# Altium project ultrabassman-pcba.PrjPcb
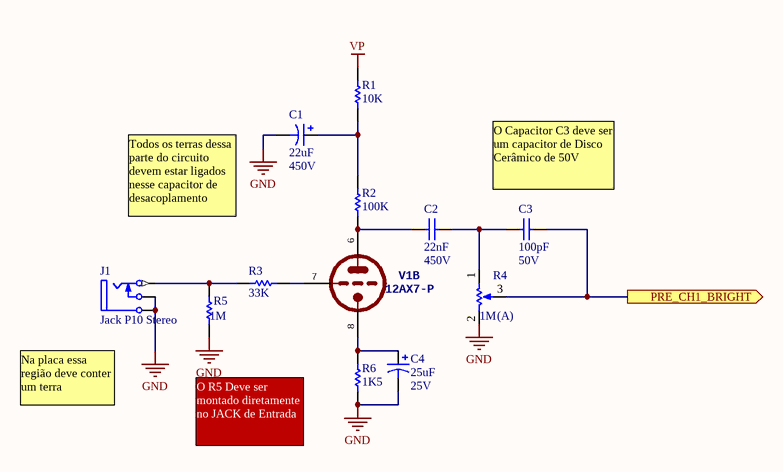
[diagram p0: preamp_chanel1_bright.SchDoc]
6 sheets, 93 parts. Net scope: global (net labels, ports and power ports of the same name join across sheets).
Board file: PCB_A.PcbDoc
Sheets:
  preamp_chanel1_bright.SchDoc
  preamp_chanel2_normal.SchDoc
  preamp_gain_stage_2.SchDoc
  fxloop.SchDoc
  poweramp_phase_splitter.SchDoc
  heaters.SchDoc

## Sheet preamp_chanel1_bright.SchDoc: Bassman Preamp Chanel 1 Bright
size A4; ProjectName: Ultra Bassman 50W

### Parts
C1  value 22uF  Voltage: 450V  [RAD-POL-7.6-15]  (hidden comment: Cap Pol Rad)
C2  value 22nF  Voltage: 450V  [ORANGE-DROP-100nF]  (hidden comment: Polyester Film)
C3  value 100pF  Voltage: 50V  [RAD-0.2]  (hidden comment: Ceramic Cap)
C4  value 25uF  Voltage: 25V  [AXIAL-POL-30mm]  (hidden comment: Cap Pol Axial)
J1  Jack P10 Stereo  [JACK-STEREO-3PAD]
R1  value 10K  [AXIAL-0.6]  (hidden comment: Metal Film Resistor 1/2W)
R2  value 100K  [AXIAL-0.6]  (hidden comment: Metal Film Resistor 1/2W)
R3  value 33K  [AXIAL-0.6]  (hidden comment: Metal Film Resistor 1/2W)
R4  value 1M  TYPE: (A)  [pot_alpha - 2.54mm]  (hidden comment: ALPHA Potentiometer)
R5  value 1M  [AXIAL-0.6]  (hidden comment: Metal Film Resistor 1/2W)  (mechanical)
R6  value 1K5  [AXIAL-0.6]  (hidden comment: Metal Film Resistor 1/2W)
V1  12AX7-P  [NOVAL]  (part B of 3)

### Ports
PRE_CH1_BRIGHT (out)

### Nets
GND: C1.2 C4.2 J1.2(TN) J1.5(S) R4.2(BOT) R5.1 R6.1
VP: R1.2
PRE_CH1_BRIGHT: C3.2 R4.3(TAP) ; port PRE_CH1_BRIGHT
NetC1_1: C1.1 R1.1 R2.2
NetC2_1: C2.1 R2.1 V1.6(TA)
NetC2_2: C2.2 C3.1 R4.1(TOP)
NetC4_1: C4.1 R6.2 V1.8(TK)
NetJ1_1: J1.1(T) R3.2 R5.2
NetR3_1: R3.1 V1.7(TG)

### Notes on the sheet
- Todos os terras dessa parte do circuito devem estar ligados nesse capacitor de desacoplamento
- (near C3) O Capacitor C3 deve ser um capacitor de Disco Cerâmico de 50V
- (near J1) Na placa essa região deve conter um terra
- O R5 Deve ser montado diretamente no JACK de Entrada

### Library data of the parts
C1 = Cap Pol Rad: Polarized Capacitor (Axial); Published: 8-Jun-2000; LatestRevisionDate: 17-Jul-2002; LatestRevisionNote: Re-released for DXP Platform.; PackageReference: POLAR0.8; Publisher: Altium Limited; PackageDescription: Polarized Capacitor; 2 Leads
C2 = Cap-PFilm: Capacitor; Published: 8-Jun-2000; LatestRevisionDate: 17-Jul-2002; LatestRevisionNote: Re-released for DXP Platform.; PackageReference: RAD-0.3; Publisher: Altium Limited; PackageDescription: Radial Cap, Thru-Hole; 2 Leads; 0.3 in Pin Spacing
C3 = Cap-Ceramic-Small: Capacitor; Published: 8-Jun-2000; LatestRevisionDate: 17-Jul-2002; LatestRevisionNote: Re-released for DXP Platform.; PackageReference: RAD-0.3; Publisher: Altium Limited; PackageDescription: Radial Cap, Thru-Hole; 2 Leads; 0.3 in Pin Spacing
C4 = Cap Pol Axial: Polarized Capacitor Axial; Published: 8-Jun-2000; LatestRevisionDate: 12-Feb-2014; LatestRevisionNote: Re-released for DXP Platform.; PackageReference: POLAR0.8; Publisher: Whitesheep Amps; PackageDescription: Polarized Capacitor; 2 Leads
J1 = Jack P10 Stereo: Jack Socket, 1/4" [6.5mm], Thru-Hole, Vertical, 2-Conductor with Tip closed; PackageDocument: 2003; PCB_Layout: Complies with manufacturer's recommendation.; DrillAndSlotSize: Corresponds to nominal value.; LatestRevisionDate: 15-Jul-2004; LatestRevisionNote: Component Replaced & renamed from "Phonejack".; DatasheetDocument: 2003; PackageReference: S1VS_SNB; Publisher: Altium Limited; ComponentLink1Description: Manufacturer Link; ComponentLink1URL: http://www.cliffuk.co.uk/
R1-R3 R5 R6 = Res Metal Film 1/2W: Semiconductor Resistor; Published: 8-Jun-2000; LatestRevisionDate: 17-Jul-2002; LatestRevisionNote: 12-Fev-2014; PackageReference: AXIAL-0.6; Publisher: Whitesheep Amps; PackageDescription: Axial Device, Thru-Hole; 2 Leads; 0.5 in Pin Spacing; Power: 1/2W
R4 = alpha-pot: Potentiometer; Sim Note: Enter the Resistance value and the set point into parameter fields.; Set Position: 0.5; Published: 8-Jun-2000; LatestRevisionDate: 17-Jul-2002; LatestRevisionNote: Re-released for DXP Platform.; PackageReference: VR5; Publisher: Altium Limited; PackageDescription: Variable Resistor, Thru-Hole; 3 Leads

## Sheet preamp_chanel2_normal.SchDoc
size A4
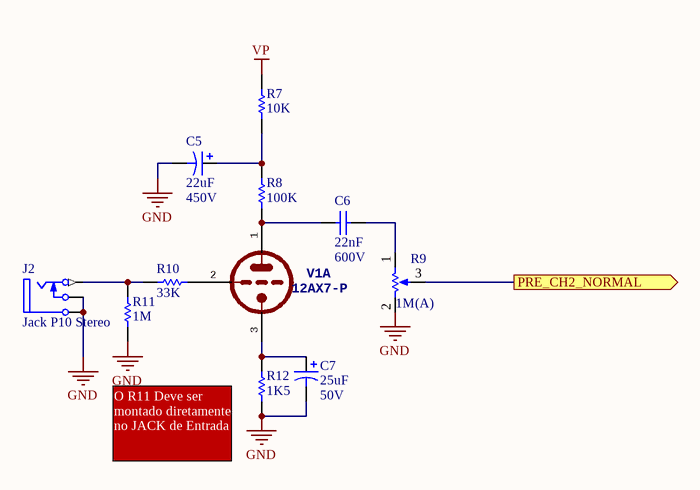
[diagram p1: preamp_chanel2_normal.SchDoc]

### Parts
C5  value 22uF  Voltage: 450V  [RAD-POL-7.6-15]  (hidden comment: Cap Pol Rad)
C6  value 22nF  Voltage: 600V  [ORANGE-DROP-100nF]  (hidden comment: Orange Drop Capacitor)
C7  value 25uF  Voltage: 50V  [AXIAL-POL-30mm]  (hidden comment: Cap Pol Axial)
J2  Jack P10 Stereo  [JACK-STEREO-3PAD]
R7  value 10K  [AXIAL-0.6]  (hidden comment: Metal Film Resistor 1/2W)
R8  value 100K  [AXIAL-0.6]  (hidden comment: Metal Film Resistor 1/2W)
R9  value 1M  TYPE: (A)  [pot_alpha - 2.54mm]  (hidden comment: ALPHA Potentiometer)
R10  value 33K  [AXIAL-0.6]  (hidden comment: Metal Film Resistor 1/2W)
R11  value 1M  [AXIAL-0.6]  (hidden comment: Metal Film Resistor 1/2W)  (mechanical)
R12  value 1K5  [AXIAL-0.6]  (hidden comment: Metal Film Resistor 1/2W)
V1  12AX7-P  [NOVAL]  (part A of 3)

### Ports
PRE_CH2_NORMAL (out)

### Nets
GND: C5.2 C7.2 J2.2(TN) J2.5(S) R9.2(BOT) R11.1 R12.1
VP: R7.2
PRE_CH2_NORMAL: R9.3(TAP) ; port PRE_CH2_NORMAL
NetC5_1: C5.1 R7.1 R8.2
NetC6_1: C6.1 R8.1 V1.1(TA)
NetC6_2: C6.2 R9.1(TOP)
NetC7_1: C7.1 R12.2 V1.3(TK)
NetJ2_1: J2.1(T) R10.2 R11.2
NetR10_1: R10.1 V1.2(TG)

### Notes on the sheet
- (near R12) O R11 Deve ser montado diretamente no JACK de Entrada

### Library data of the parts
C5 = Cap Pol Rad: Polarized Capacitor (Axial); Published: 8-Jun-2000; LatestRevisionDate: 17-Jul-2002; LatestRevisionNote: Re-released for DXP Platform.; PackageReference: POLAR0.8; Publisher: Altium Limited; PackageDescription: Polarized Capacitor; 2 Leads
C6 = Cap-Orange-DROP-22nF-600V: Capacitor; Published: 8-Jun-2000; LatestRevisionDate: 17-Jul-2002; LatestRevisionNote: Re-released for DXP Platform.; PackageReference: RAD-0.3; Publisher: Altium Limited; PackageDescription: Radial Cap, Thru-Hole; 2 Leads; 0.3 in Pin Spacing
C7 = Cap Pol Axial: Polarized Capacitor Axial; Published: 8-Jun-2000; LatestRevisionDate: 12-Feb-2014; LatestRevisionNote: Re-released for DXP Platform.; PackageReference: POLAR0.8; Publisher: Whitesheep Amps; PackageDescription: Polarized Capacitor; 2 Leads
J2 = Jack P10 Stereo: as J1 on sheet preamp_chanel1_bright; LatestRevisionDate: 15-Jul-2004; LatestRevisionNote: Component Replaced & renamed from "Phonejack".; DatasheetDocument: 2003; PackageReference: S1VS_SNB; Publisher: Altium Limited; ComponentLink1Description: Manufacturer Link; ComponentLink1URL: http://www.cliffuk.co.uk/
R7 R8 R10-R12 = Res Metal Film 1/2W: Semiconductor Resistor; Published: 8-Jun-2000; LatestRevisionDate: 17-Jul-2002; LatestRevisionNote: 12-Fev-2014; PackageReference: AXIAL-0.6; Publisher: Whitesheep Amps; PackageDescription: Axial Device, Thru-Hole; 2 Leads; 0.5 in Pin Spacing; Power: 1/2W
R9 = alpha-pot: as R4 on sheet preamp_chanel1_bright; Published: 8-Jun-2000; LatestRevisionDate: 17-Jul-2002; LatestRevisionNote: Re-released for DXP Platform.; PackageReference: VR5; Publisher: Altium Limited; PackageDescription: Variable Resistor, Thru-Hole; 3 Leads

## Sheet preamp_gain_stage_2.SchDoc
size A4
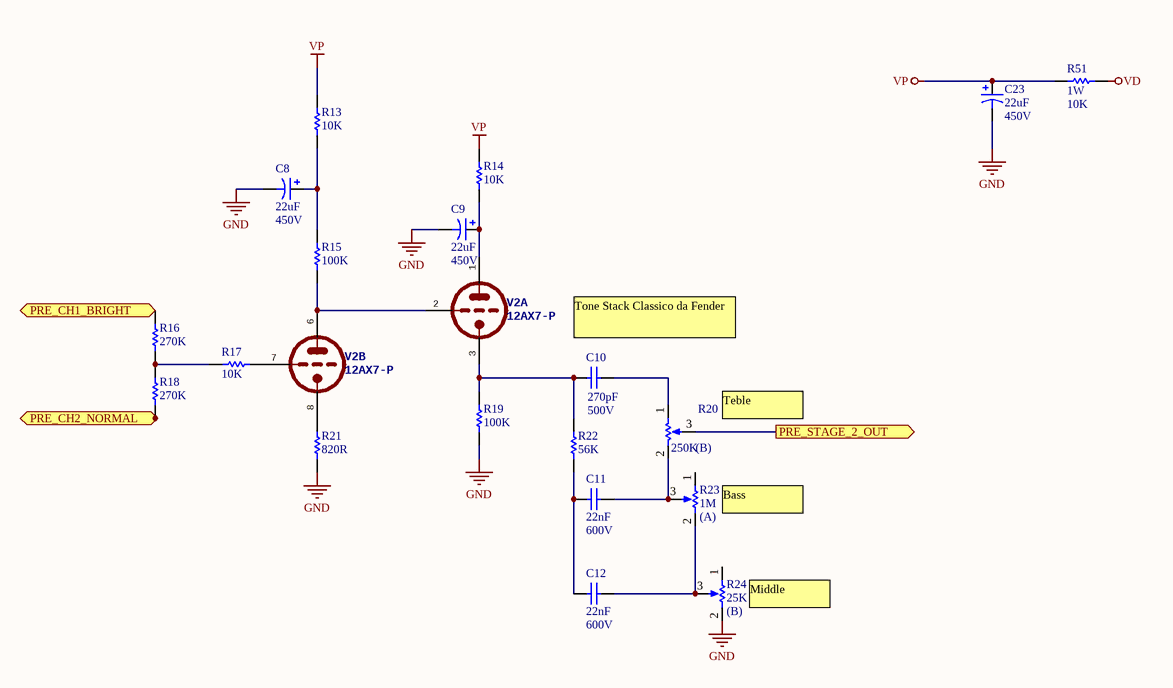
[diagram p2: preamp_gain_stage_2.SchDoc]

### Parts
C8  value 22uF  Voltage: 450V  [RAD-POL-7.6-15]  (hidden comment: Cap Pol Rad)
C9  value 22uF  Voltage: 450V  [RAD-POL-7.6-15]  (hidden comment: Cap Pol Rad)
C10  value 270pF  Voltage: 500V  [RAD-0.3]  (hidden comment: Cap)
C11  value 22nF  Voltage: 600V  [ORANGE-DROP-22nF-600V]  (hidden comment: Orange Drop Capacitor)
C12  value 22nF  Voltage: 600V  [ORANGE-DROP-22nF-600V]  (hidden comment: Orange Drop Capacitor)
C23  value 22uF  Voltage: 450V  [RAD-POL-7.6-15]  (hidden comment: Cap Pol Rad)
R13  value 10K  [AXIAL-0.6]  (hidden comment: Metal Film Resistor 1/2W)
R14  value 10K  [AXIAL-0.6]  (hidden comment: Metal Film Resistor 1/2W)
R15  value 100K  [AXIAL-0.6]  (hidden comment: Metal Film Resistor 1/2W)
R16  value 270K  [AXIAL-0.6]  (hidden comment: Metal Film Resistor 1/2W)
R17  value 10K  [AXIAL-0.6]  (hidden comment: Metal Film Resistor 1/2W)
R18  value 270K  [AXIAL-0.6]  (hidden comment: Metal Film Resistor 1/2W)
R19  value 100K  [AXIAL-0.6]  (hidden comment: Metal Film Resistor 1/2W)
R20  value 250K  TYPE: (B)  [pot_alpha - 2.54mm]  (hidden comment: ALPHA Potentiometer)
R21  value 820R  [AXIAL-0.6]  (hidden comment: Metal Film Resistor 1/2W)
R22  value 56K  [AXIAL-0.6]  (hidden comment: Metal Film Resistor 1/2W)
R23  value 1M  TYPE: (A)  [pot_alpha - 2.54mm]  (hidden comment: ALPHA Potentiometer)
R24  value 25K  TYPE: (B)  [pot_alpha - 2.54mm]  (hidden comment: ALPHA Potentiometer)
R51  value 10K  Power: 1W  [AXIAL-0.6]  (hidden comment: Metal Film Resistor 1W)
V2  12AX7-P  [NOVAL]  (parts A,B of 3)

### Ports
PRE_CH1_BRIGHT (in), PRE_CH2_NORMAL (in), PRE_STAGE_2_OUT (out)

### Nets
GND: C8.2 C9.2 C23.2 R19.2 R21.2 R24.2(BOT)
VD: R51.2
VP: C23.1 R13.1 R14.1 R51.1
PRE_CH1_BRIGHT: R16.1 ; port PRE_CH1_BRIGHT
PRE_STAGE_2_OUT: R20.3(TAP) ; port PRE_STAGE_2_OUT
NetC8_1: C8.1 R13.2 R15.1
NetC9_1: C9.1 R14.2 V2.1(TA)
NetC10_1: C10.1 R19.1 R22.1 V2.3(TK)
NetC10_2: C10.2 R20.1(TOP)
NetC11_1: C11.1 C12.1 R22.2
NetC11_2: C11.2 R20.2(BOT) R23.3(TAP)
NetC12_2: C12.2 R23.2(BOT) R24.3(TAP)
NetR15_2: R15.2 V2.2(TG) V2.6(TA)
NetR16_2: R16.2 R17.1 R18.1
NetR17_2: R17.2 V2.7(TG)
NetR21_1: R21.1 V2.8(TK)

Not connected (* = marked no-connect by the designer): R18 2; R23 1(TOP); R24 1(TOP)

### Notes on the sheet
- (near C10) Tone Stack Classico da Fender
- (near R20) Teble
- (near R23) Bass
- (near R24) Middle

### Library data of the parts
C8 C9 C23 = Cap Pol Rad: Polarized Capacitor (Axial); Published: 8-Jun-2000; LatestRevisionDate: 17-Jul-2002; LatestRevisionNote: Re-released for DXP Platform.; PackageReference: POLAR0.8; Publisher: Altium Limited; PackageDescription: Polarized Capacitor; 2 Leads
C10 = Cap: Capacitor; Published: 8-Jun-2000; LatestRevisionDate: 17-Jul-2002; LatestRevisionNote: Re-released for DXP Platform.; PackageReference: RAD-0.3; Publisher: Altium Limited; PackageDescription: Radial Cap, Thru-Hole; 2 Leads; 0.3 in Pin Spacing
C11 C12 = Cap-Orange-DROP-22nF-600V: Capacitor; ManufacturerPartNumber: 715P22356KD3; Published: 23-April-2014; LatestRevisionDate: 23-April-2014; LatestRevisionNote: Creating the document; PackageReference: Orange Drop; Publisher: Linda HB Amplifiers; PackageDescription: Radial Cap, Thru-Hole; 2 Leads; 9.75mm Pin Spacing
R13-R19 R21 R22 = Res Metal Film 1/2W: Semiconductor Resistor; Published: 8-Jun-2000; LatestRevisionDate: 17-Jul-2002; LatestRevisionNote: 12-Fev-2014; PackageReference: AXIAL-0.6; Publisher: Whitesheep Amps; PackageDescription: Axial Device, Thru-Hole; 2 Leads; 0.5 in Pin Spacing; Power: 1/2W
R20 R23 R24 = alpha-pot: as R4 on sheet preamp_chanel1_bright; Published: 8-Jun-2000; LatestRevisionDate: 17-Jul-2002; LatestRevisionNote: Re-released for DXP Platform.; PackageReference: VR5; Publisher: Altium Limited; PackageDescription: Variable Resistor, Thru-Hole; 3 Leads
R51 = Res Wire Wound 1W: Semiconductor Resistor; Published: 8-Jun-2000; LatestRevisionDate: 29-Mar-2014; LatestRevisionNote: 19-Mar-2014; PackageReference: AXIAL-0.5; Publisher: Linda Hand Buit Amplifiers; PackageDescription: Axial Device, Thru-Hole; 2 Leads; 0.5 in Pin Spacing

## Sheet fxloop.SchDoc
size A4
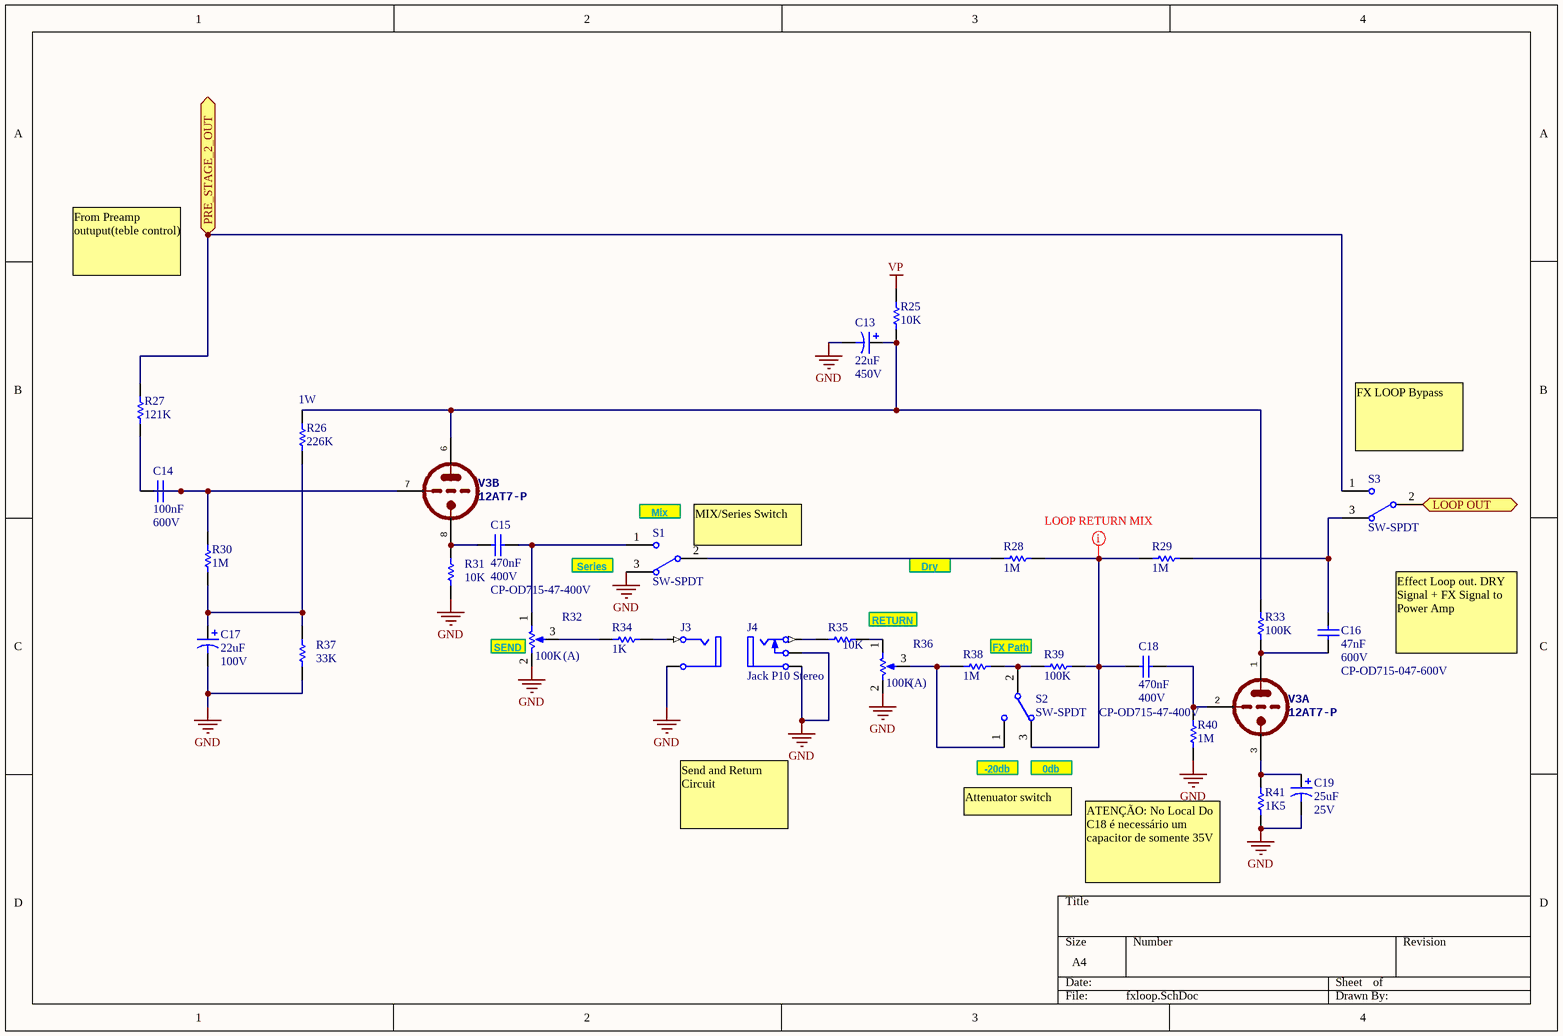
[diagram p3: fxloop.SchDoc]

### Parts
C13  value 22uF  Voltage: 450V  [RAD-POL-7.6-15]  (hidden comment: Cap Pol Rad)
C14  value 100nF  Voltage: 600V  [ORANGE-DROP-100nF]  (hidden comment: Orange Drop Capacitor)
C15  value 470nF  Voltage: 400V  TUBE_DEPOT_SN: CP-OD715-47-400V  [ORANGE-DROP-470-nF-400V]  (hidden comment: Orange Drop Capacitor)
C16  value 47nF  Voltage: 600V  TUBEDEPOT_SN: CP-OD715-047-600V  [ORANGE-DROP-47nF-600V]  (hidden comment: Orange Drop Capacitor)
C17  value 22uF  Voltage: 100V  [RAD-POL-16x20x7.5]  (hidden comment: Cap Pol Radial Vishay 22uF 100V)
C18  value 470nF  Voltage: 400V  TUBE_DEPOT_SN: CP-OD715-47-400V  [ORANGE-DROP-470-nF-400V]  (hidden comment: Orange Drop Capacitor)
C19  value 25uF  Voltage: 25V  [AXIAL-POL-30mm]  (hidden comment: Cap Pol Axial)
J3  Jack Mono  [JACK-MONO-PCB-MINI]  (value not drawn)
J4  Jack P10 Stereo  [JACK-STEREO-3PAD]
R25  value 10K  [AXIAL-0.6]  (hidden comment: Metal Film Resistor 1/2W)
R26  value 226K  Power: 1W  [AXIAL-0.6]  (hidden comment: Metal Film Resistor 1/2W)
R27  value 121K  [AXIAL-0.6]  (hidden comment: Metal Film Resistor 1/2W)
R28  value 1M  [AXIAL-0.6]  (hidden comment: Metal Film Resistor 1/2W)
R29  value 1M  [AXIAL-0.6]  (hidden comment: Metal Film Resistor 1/2W)
R30  value 1M  [AXIAL-0.6]  (hidden comment: Metal Film Resistor 1/2W)
R31  value 10K  [AXIAL-0.6]  (hidden comment: Metal Film Resistor 1/2W)
R32  value 100K  TYPE: (A)  [pot_alpha - 2.54mm]  (hidden comment: ALPHA Potentiometer)
R33  value 100K  [AXIAL-0.6]  (hidden comment: Metal Film Resistor 1/2W)
R34  value 1K  [AXIAL-0.6]  (hidden comment: Metal Film Resistor 1/2W)
R35  value 10K  [AXIAL-0.6]  (hidden comment: Metal Film Resistor 1/2W)
R36  value 100K  TYPE: (A)  [pot_alpha - 2.54mm]  (hidden comment: ALPHA Potentiometer)
R37  value 33K  [AXIAL-0.6]  (hidden comment: Metal Film Resistor 1/2W)
R38  value 1M  [AXIAL-0.6]  (hidden comment: Metal Film Resistor 1/2W)
R39  value 100K  [AXIAL-0.6]  (hidden comment: Metal Film Resistor 1/2W)
R40  value 1M  [AXIAL-0.6]  (hidden comment: Metal Film Resistor 1/2W)
R41  value 1K5  [AXIAL-0.6]  (hidden comment: Metal Film Resistor 1/2W)
S1  SW-SPDT  [SPDT]
S2  SW-SPDT  [SPDT]
S3  SW-SPDT  [SPDT]
V3  12AT7-P  [NOVAL]  (parts A,B of 3)

### Ports
LOOP OUT (out), PRE_STAGE_2_OUT (in)

### Nets
GND: C13.2 C17.2 C19.2 J3.2(S) J4.2(TN) J4.5(S) R31.2 R32.2(BOT) R36.2(BOT) R37.2 R40.1 R41.1 S1.3
VP: R25.2
LOOP OUT: S3.2 ; port LOOP OUT
PRE_STAGE_2_OUT: R27.2 S3.1 ; port PRE_STAGE_2_OUT
NetC13_1: C13.1 R25.1 R26.1 R33.2 V3.6(TA)
NetC14_1: C14.1 R27.1
NetC14_2: C14.2 R30.1 V3.7(TG)
NetC15_1: C15.1 R31.1 V3.8(TK)
NetC15_2: C15.2 R32.1(TOP) S1.1
NetC16_1: C16.1 R33.1 V3.1(TA)
NetC16_2: C16.2 R29.2 S3.3
NetC17_1: C17.1 R26.2 R30.2 R37.1
NetC18_1: C18.1 R28.2 R29.1 R39.2 S2.3
NetC18_2: C18.2 R40.2 V3.2(TG)
NetC19_1: C19.1 R41.2 V3.3(TK)
NetJ3_1: J3.1(T) R34.2
NetJ4_1: J4.1(T) R35.1
NetR28_1: R28.1 S1.2
NetR32_3: R32.3(TAP) R34.1
NetR35_2: R35.2 R36.1(TOP)
NetR36_3: R36.3(TAP) R38.1 S2.1
NetR38_2: R38.2 R39.1 S2.2

### Layout directives
net class Undefined: NetC18_1

### Notes on the sheet
- From Preamp outuput(teble control)
- (near S3) FX LOOP Bypass
- (near S1) Mix
- Series
- (near S1) MIX/Series Switch
- Dry Path
- (near R32) SEND
- RETURN
- FX Path
- Effect Loop out. DRY Signal + FX Signal to Power Amp
- (near S2) -20db
- (near S2) 0db
- Send and Return Circuit
- Attenuator switch
- ATENÇÃO: No Local Do C18 é necessário um capacitor de somente 35V

### Library data of the parts
C13 = Cap Pol Rad: Polarized Capacitor (Axial); Published: 8-Jun-2000; LatestRevisionDate: 17-Jul-2002; LatestRevisionNote: Re-released for DXP Platform.; PackageReference: POLAR0.8; Publisher: Altium Limited; PackageDescription: Polarized Capacitor; 2 Leads
C14 = Cap-Orange-DROP_600V: Capacitor; Published: 8-Jun-2000; LatestRevisionDate: 17-Jul-2002; LatestRevisionNote: Re-released for DXP Platform.; PackageReference: RAD-0.3; Publisher: Altium Limited; PackageDescription: Radial Cap, Thru-Hole; 2 Leads; 0.3 in Pin Spacing
C15 C18 = Cap-Orange-DROP-470nF-400V: Capacitor; ManufacturerPartNumber: 715P47494M; Published: 17-May-2014; LatestRevisionDate: 17-May-2014; LatestRevisionNote: Adding component; PackageReference: Orange Drop; Publisher: Linda HB Amplifiers; PackageDescription: Radial Cap, Thru-Hole; 2 Leads; 9.75mm Pin Spacing
C16 = Cap-Orange-DROP-47nF-600V: Capacitor; ManufacturerPartNumber: 715P47396L; Published: 18-May-2014; LatestRevisionDate: 18-May-2014; LatestRevisionNote: Re-released for DXP Platform.; PackageReference: RAD-0.3; Publisher: Linda HB Amps; PackageDescription: Radial Cap, Thru-Hole; 2 Leads; 0.3 in Pin Spacing
C17 = Cap Pol Radial Vishay 22uF 100V: Vishay 22uF 100V Polarized Capacitor (Radial); 2 Leads; Part Number: 142 RHS; Published: 8-Jun-2000; LatestRevisionDate: 17-Jul-2002; LatestRevisionNote: Re-released for DXP Platform.; PackageReference: POLAR0.8; Publisher: Altium Limited; PackageDescription: Polarized Capacitor; 2 Leads
C19 = Cap Pol Axial: Polarized Capacitor Axial; Published: 8-Jun-2000; LatestRevisionDate: 12-Feb-2014; LatestRevisionNote: Re-released for DXP Platform.; PackageReference: POLAR0.8; Publisher: Whitesheep Amps; PackageDescription: Polarized Capacitor; 2 Leads
J3 = Jack Moto P10: Jack Socket, Thru-Hole, Vertical, 2-Conductor Open Circuit; PackageDocument: 2003; PCB_Layout: Complies with manufacturer's recommendation.; DrillAndSlotSize: Corresponds to nominal value.; LatestRevisionDate: 15-Jul-2004; LatestRevisionNote: Component Replaced.; DatasheetDocument: 2003; PackageReference: S1VS_SNS; Publisher: Altium Limited; ComponentLink1Description: Manufacturer Link; ComponentLink1URL: http://www.cliffuk.co.uk/
J4 = Jack P10 Stereo: as J1 on sheet preamp_chanel1_bright; LatestRevisionDate: 15-Jul-2004; LatestRevisionNote: Component Replaced & renamed from "Phonejack".; DatasheetDocument: 2003; PackageReference: S1VS_SNB; Publisher: Altium Limited; ComponentLink1Description: Manufacturer Link; ComponentLink1URL: http://www.cliffuk.co.uk/
R25-R31 R33-R35 R37-R41 = Res Metal Film 1/2W: Semiconductor Resistor; Published: 8-Jun-2000; LatestRevisionDate: 17-Jul-2002; LatestRevisionNote: 12-Fev-2014; PackageReference: AXIAL-0.6; Publisher: Whitesheep Amps; PackageDescription: Axial Device, Thru-Hole; 2 Leads; 0.5 in Pin Spacing
  R25 R27-R31 R33-R35 R37-R41: Power: 1/2W
R32 R36 = alpha-pot: as R4 on sheet preamp_chanel1_bright; Published: 8-Jun-2000; LatestRevisionDate: 17-Jul-2002; LatestRevisionNote: Re-released for DXP Platform.; PackageReference: VR5; Publisher: Altium Limited; PackageDescription: Variable Resistor, Thru-Hole; 3 Leads
S1-S3 = SW-SPDT: SPDT Subminiature Toggle Switch, Right Angle Mounting, Vertical Actuation; Published: 24-Mar-1999; LatestRevisionDate: 17-Dec-2003; LatestRevisionNote: Schematic revised, PCB Footprint replaced.; DatasheetVersion: 05-Dec-2000; PackageReference: TL36WW15050; Publisher: Altium Limited; PackageDescription: Switch; 4 Leads; ComponentLink1Description: Manufacturer Link; ComponentLink1URL: http://www.apem.com

## Sheet poweramp_phase_splitter.SchDoc: Phase Spliter Ultra Bassman
size A4; Date: 22/02/2014; DrawnBy: Eduardo Marques; Engineer: Eduardo Marques; DocumentNumber: 4; DocumentName: Bassman PhaseSplitter
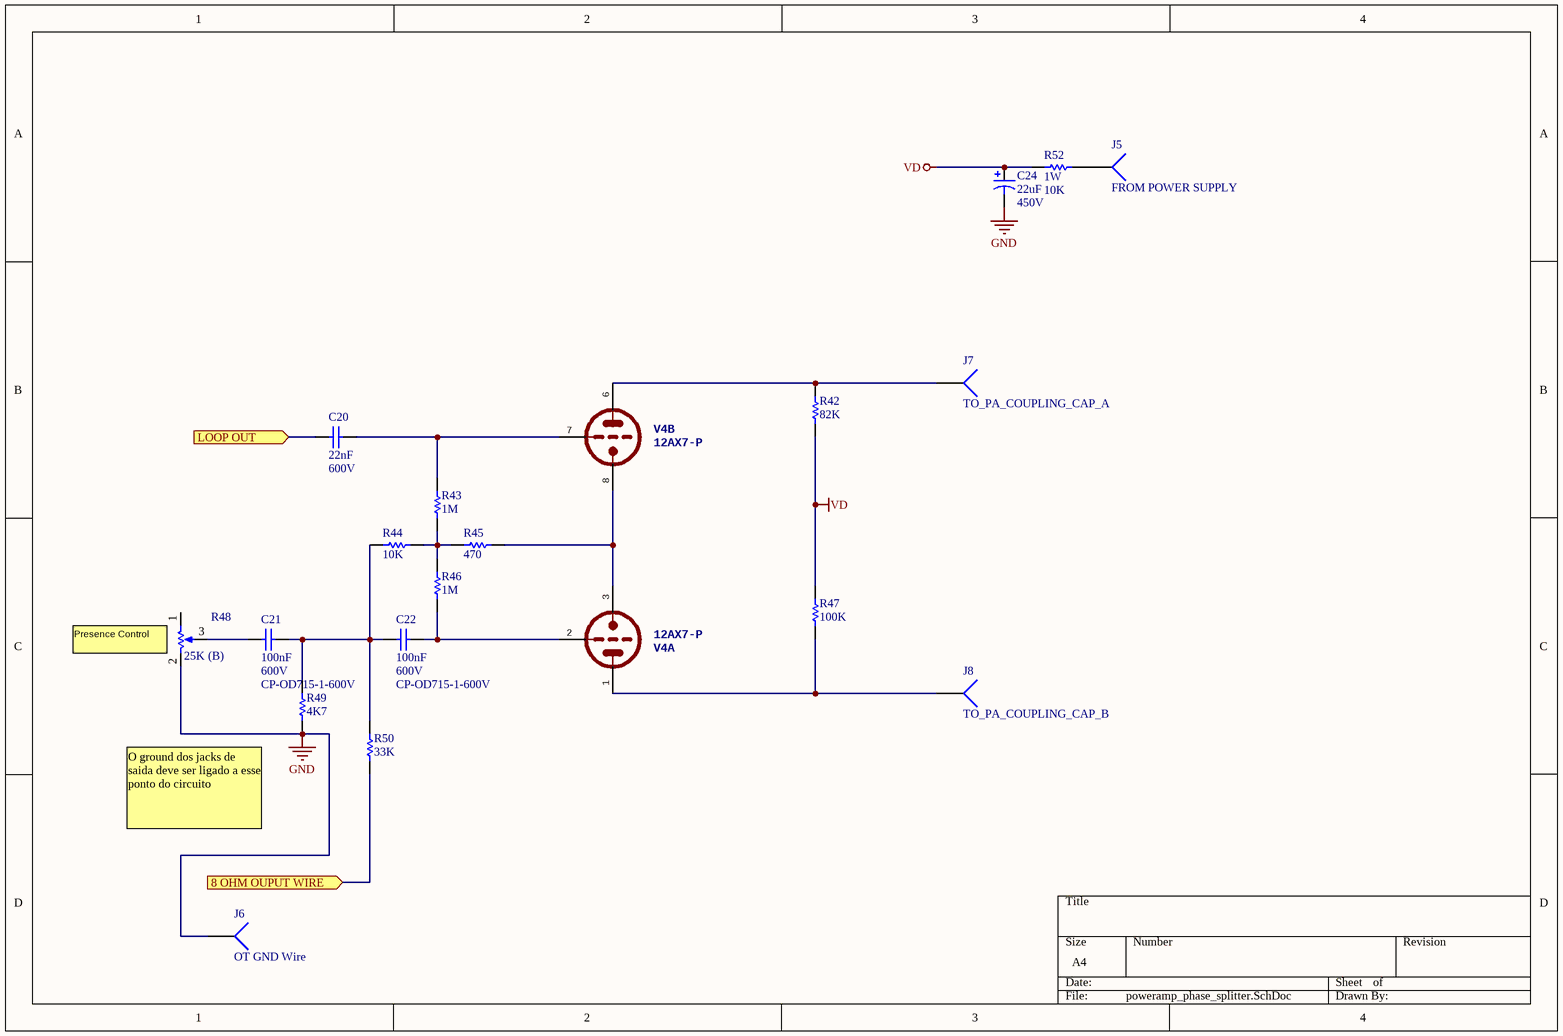
[diagram p4: poweramp_phase_splitter.SchDoc]

### Parts
C20  value 22nF  Voltage: 600V  [ORANGE-DROP-22nF-600V]  (hidden comment: Orange Drop Capacitor)
C21  value 100nF  Voltage: 600V  TUBEDEPOT_SN: CP-OD715-1-600V  [ORANGE-DROP-100nF-600V]  (hidden comment: Orange Drop Capacitor)
C22  value 100nF  Voltage: 600V  TUBEDEPOT_SN: CP-OD715-1-600V  [ORANGE-DROP-100nF-600V]  (hidden comment: Orange Drop Capacitor)
C24  value 22uF  Voltage: 450V  [RAD-POL-7.6-15]  (hidden comment: Cap Pol Rad)
J5  FROM POWER SUPPLY  [PIN1]
J6  OT GND Wire  [PIN1]
J7  TO_PA_COUPLING_CAP_A  [PIN1]
J8  TO_PA_COUPLING_CAP_B  [PIN1]
R42  value 82K  [AXIAL-0.6]  (hidden comment: Metal Film Resistor 1/2W)
R43  value 1M  [AXIAL-0.6]  (hidden comment: Metal Film Resistor 1/2W)
R44  value 10K  [AXIAL-0.6]  (hidden comment: Metal Film Resistor 1/2W)
R45  value 470  [AXIAL-0.6]  (hidden comment: Metal Film Resistor 1/2W)
R46  value 1M  [AXIAL-0.6]  (hidden comment: Metal Film Resistor 1/2W)
R47  value 100K  [AXIAL-0.6]  (hidden comment: Metal Film Resistor 1/2W)
R48  value 25K  TYPE: (B)  [pot_alpha - 2.54mm]  (hidden comment: ALPHA Potentiometer)
R49  value 4K7  [AXIAL-0.6]  (hidden comment: Metal Film Resistor 1/2W)
R50  value 33K  [AXIAL-0.6]  (hidden comment: Metal Film Resistor 1/2W)
R52  value 10K  Power: 1W  [AXIAL-0.6]  (hidden comment: Metal Film Resistor 1W)
V4  12AX7-P  [NOVAL]  (parts A,B of 3)

### Ports
8 OHM OUPUT WIRE (in), LOOP OUT (in)

### Nets
GND: C24.2 J6.1 R48.2(BOT) R49.1
VD: C24.1 R42.2 R47.1 R52.2
8 OHM OUPUT WIRE: R50.1 ; port 8 OHM OUPUT WIRE
LOOP OUT: C20.1 ; port LOOP OUT
NetC20_2: C20.2 R43.1 V4.7(TG)
NetC21_1: C21.1 R48.3(TAP)
NetC21_2: C21.2 C22.1 R44.2 R49.2 R50.2
NetC22_2: C22.2 R46.2 V4.2(TG)
NetJ5_1: J5.1 R52.1
NetJ7_1: J7.1 R42.1 V4.6(TA)
NetJ8_1: J8.1 R47.2 V4.1(TA)
NetR43_2: R43.2 R44.1 R45.2 R46.1
NetR45_1: R45.1 V4.3(TK) V4.8(TK)

Not connected (* = marked no-connect by the designer): R48 1(TOP)

### Notes on the sheet
- (near R48) Presence Control
- (near R49) O ground dos jacks de saida deve ser ligado a esse ponto do circuito

### Library data of the parts
C20 = Cap-Orange-DROP-22nF-600V: as C11 on sheet preamp_gain_stage_2; Published: 23-April-2014; LatestRevisionDate: 23-April-2014; LatestRevisionNote: Creating the document; PackageReference: Orange Drop; Publisher: Linda HB Amplifiers; PackageDescription: Radial Cap, Thru-Hole; 2 Leads; 9.75mm Pin Spacing
C21 C22 = Cap-Orange-DROP-100nF-600V: Capacitor; ManufacturerPartNumber: 715P10496L; Published: 8-Jun-2000; LatestRevisionDate: 17-Jul-2002; LatestRevisionNote: Re-released for DXP Platform.; PackageReference: RAD-0.3; Publisher: Altium Limited; PackageDescription: Radial Cap, Thru-Hole; 2 Leads; 0.3 in Pin Spacing
C24 = Cap Pol Rad: Polarized Capacitor (Axial); Published: 8-Jun-2000; LatestRevisionDate: 17-Jul-2002; LatestRevisionNote: Re-released for DXP Platform.; PackageReference: POLAR0.8; Publisher: Altium Limited; PackageDescription: Polarized Capacitor; 2 Leads
J5 J7 J8 = Socket: LatestRevisionDate: 17-Jul-2002; LatestRevisionNote: Re-released for DXP Platform.; Publisher: Altium Limited
J6 = Socket: FromOTGroundWire; LatestRevisionDate: 17-Jul-2002; LatestRevisionNote: Re-released for DXP Platform.; Publisher: Altium Limited
R42-R47 R49 R50 = Res Metal Film 1/2W: Semiconductor Resistor; Published: 8-Jun-2000; LatestRevisionDate: 17-Jul-2002; LatestRevisionNote: 12-Fev-2014; PackageReference: AXIAL-0.6; Publisher: Whitesheep Amps; PackageDescription: Axial Device, Thru-Hole; 2 Leads; 0.5 in Pin Spacing; Power: 1/2W
R48 = alpha-pot: as R4 on sheet preamp_chanel1_bright; Published: 8-Jun-2000; LatestRevisionDate: 17-Jul-2002; LatestRevisionNote: Re-released for DXP Platform.; PackageReference: VR5; Publisher: Altium Limited; PackageDescription: Variable Resistor, Thru-Hole; 3 Leads
R52 = Res Wire Wound 1W: Semiconductor Resistor; Published: 8-Jun-2000; LatestRevisionDate: 29-Mar-2014; LatestRevisionNote: 19-Mar-2014; PackageReference: AXIAL-0.5; Publisher: Linda Hand Buit Amplifiers; PackageDescription: Axial Device, Thru-Hole; 2 Leads; 0.5 in Pin Spacing

## Sheet heaters.SchDoc
size A4
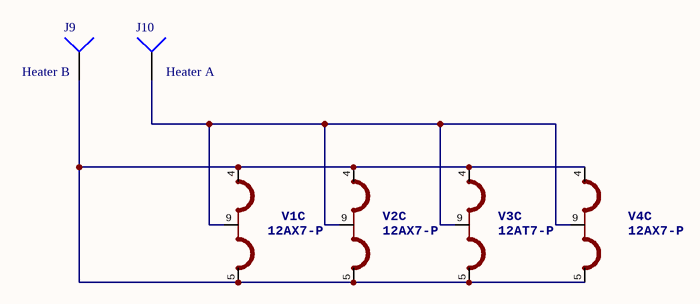
[diagram p5: heaters.SchDoc]

### Parts
J9  Heater B  [PIN1]
J10  Heater A  [PIN1]
V1  12AX7-P  [NOVAL]  (part C of 3)
V2  12AX7-P  [NOVAL]  (part C of 3)
V3  12AT7-P  [NOVAL]  (part C of 3)
V4  12AX7-P  [NOVAL]  (part C of 3)

### Nets
NetJ9_1: J9.1 V1.4(H1) V1.5(H3) V2.4(H1) V2.5(H3) V3.4(H1) V3.5(H3) V4.4(H1) V4.5(H3)
NetJ10_1: J10.1 V1.9(H2) V2.9(H2) V3.9(H2) V4.9(H2)

### Library data of the parts
J9 J10 = Socket: LatestRevisionDate: 17-Jul-2002; LatestRevisionNote: Re-released for DXP Platform.; Publisher: Altium Limited

## Nets that join several sheets
GND: preamp_chanel1_bright (7 pins), preamp_chanel2_normal (7 pins), preamp_gain_stage_2 (6 pins), fxloop (13 pins), poweramp_phase_splitter (C24.2 J6.1 R48.2 R49.1)
VD: preamp_gain_stage_2 (R51.2), poweramp_phase_splitter (C24.1 R42.2 R47.1 R52.2)
VP: preamp_chanel1_bright (R1.2), preamp_chanel2_normal (R7.2), preamp_gain_stage_2 (C23.1 R13.1 R14.1 R51.1), fxloop (R25.2)
LOOP OUT: fxloop (S3.2), poweramp_phase_splitter (C20.1)
PRE_CH1_BRIGHT: preamp_chanel1_bright (C3.2 R4.3), preamp_gain_stage_2 (R16.1)
PRE_STAGE_2_OUT: preamp_gain_stage_2 (R20.3), fxloop (R27.2 S3.1)